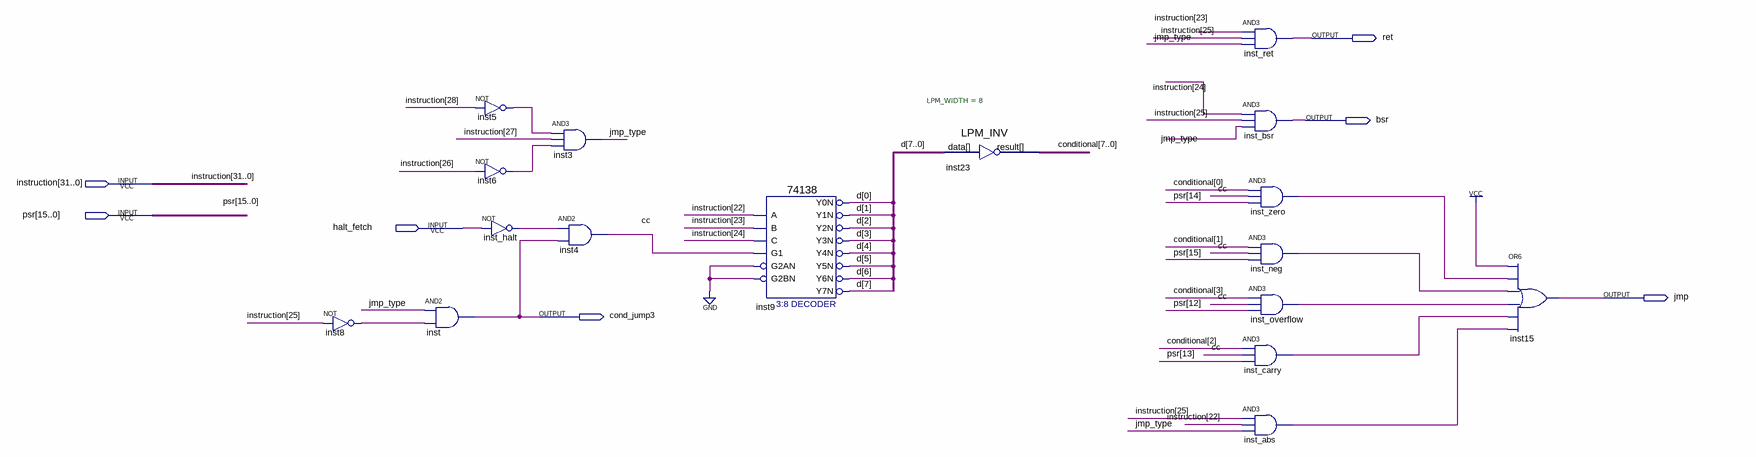
[diagram p0: schematic sheet]
// Quartus schematic pre_decoder.bdf as structural Verilog: 17 symbols, 7 pins
module pre_decoder (
  input  [31:0] instruction,
  input  [15:0] psr,
  input  halt_fetch,
  output ret,
  output bsr,
  output jmp,
  output cond_jump3
);

  wire cc, inst5_out, inst6_out, inst8_out, inst_abs_out, inst_carry_out, inst_halt_out, inst_neg_out,
       inst_overflow_out, inst_zero_out, jmp_type;
  wire [7:0] conditional, d;

  not inst8 (inst8_out, instruction[25]);
  and inst (cond_jump3, jmp_type, inst8_out);
  not inst5 (inst5_out, instruction[28]);
  not inst6 (inst6_out, instruction[26]);
  not inst_halt (inst_halt_out, halt_fetch);
  and inst3 (jmp_type, inst5_out, instruction[27], inst6_out);
  and inst4 (cc, inst_halt_out, cond_jump3);
  \74138  inst9 (
    .A(instruction[22]), .B(instruction[23]), .G1(cc), .C(instruction[24]), .G2AN(1'b0), .G2BN(1'b0),
    .Y0N(d[0]), .Y1N(d[1]), .Y2N(d[2]), .Y3N(d[3]), .Y4N(d[4]), .Y5N(d[5]), .Y6N(d[6]), .Y7N(d[7]));
  LPM_INV #(.LPM_WIDTH(8)) inst23 (.data(d), .result(conditional));
  and inst_ret (ret, instruction[23], instruction[25], jmp_type);
  and inst_bsr (bsr, instruction[24], instruction[25], jmp_type);
  and inst_zero (inst_zero_out, conditional[0], cc, psr[14]);
  and inst_neg (inst_neg_out, conditional[1], cc, psr[15]);
  and inst_overflow (inst_overflow_out, conditional[3], cc, psr[12]);
  and inst_carry (inst_carry_out, conditional[2], cc, psr[13]);
  and inst_abs (inst_abs_out, instruction[25], instruction[22], jmp_type);
  or inst15 (jmp, 1'b1, inst_zero_out, inst_neg_out, inst_overflow_out, inst_carry_out, inst_abs_out);
endmodule
